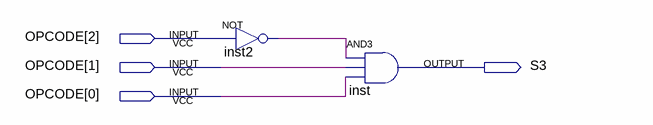
[diagram p0: schematic sheet]
// Quartus schematic DecoCOMP.bdf as structural Verilog: 2 symbols, 4 pins
module DecoCOMP (
  input  [2:0] OPCODE,
  output S3
);

  wire inst2_out;

  not inst2 (inst2_out, OPCODE[2]);
  and inst (S3, inst2_out, OPCODE[1], OPCODE[0]);
endmodule
